# Altium schematic sheet DC-DC Converter.SchDoc
size A
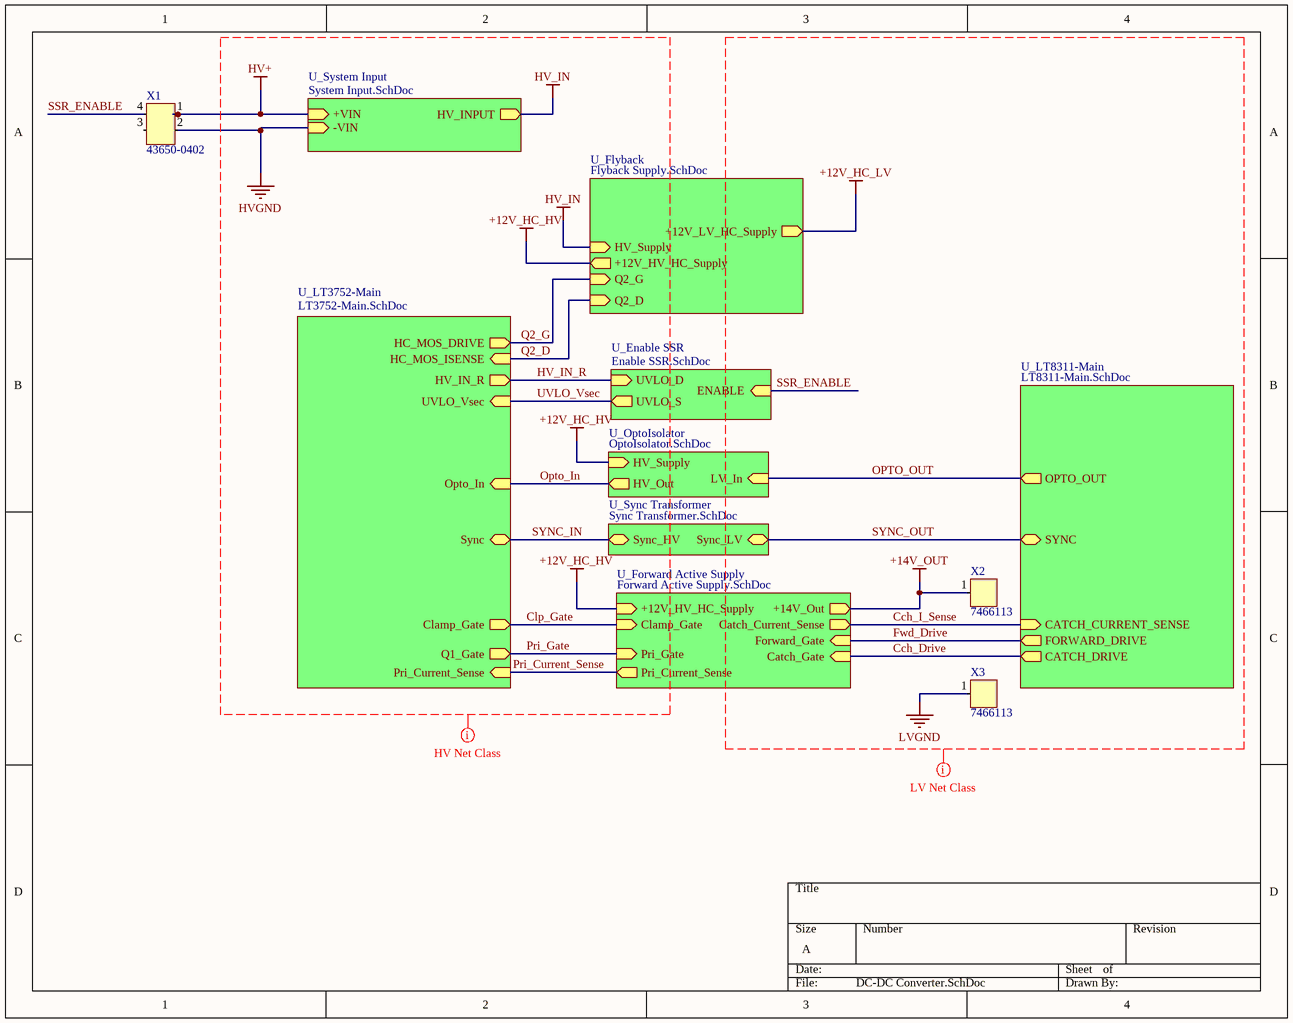
[diagram p0: DC-DC Converter.SchDoc]

## Parts
X1  43650-0402  [Molex_43650_0402]
X2  7466113  [7466113]
X3  7466113  [7466113]

## Sub-sheets
U_Enable SSR = Enable SSR.SchDoc: UVLO_D (in), ENABLE (in), UVLO_S (out)
U_Flyback = Flyback Supply.SchDoc: +12V_LV_HC_Supply (out), HV_Supply (in), Q2_G (in), +12V_HV_HC_Supply (out), Q2_D (in)
U_Forward Active Supply = Forward Active Supply.SchDoc: Clamp_Gate (in), Pri_Gate (in), Pri_Current_Sense (out), +14V_Out (out), Forward_Gate (in), Catch_Gate (in), Catch_Current_Sense (out), +12V_HV_HC_Supply (in)
U_LT3752-Main = LT3752-Main.SchDoc: Sync (bidir), Opto_In (in), Q1_Gate (out), HC_MOS_DRIVE (out), HC_MOS_ISENSE (in), Clamp_Gate (out), Pri_Current_Sense (in), UVLO_Vsec (in), HV_IN_R (out)
U_LT8311-Main = LT8311-Main.SchDoc: OPTO_OUT (out), CATCH_DRIVE (out), CATCH_CURRENT_SENSE (in), FORWARD_DRIVE (out), SYNC (bidir)
U_OptoIsolator = OptoIsolator.SchDoc: HV_Supply (in), HV_Out (out), LV_In (in)
U_Sync Transformer = Sync Transformer.SchDoc: Sync_LV (bidir), Sync_HV (bidir)
U_System Input = System Input.SchDoc: +VIN (in), -VIN (in), HV_INPUT (out)

## Nets
+12V_HC_HV: sheet U_OptoIsolator/HV_Supply, sheet U_Flyback/+12V_HV_HC_Supply, sheet U_Forward Active Supply/+12V_HV_HC_Supply
+12V_HC_LV: sheet U_Flyback/+12V_LV_HC_Supply
+14V_OUT: X2.1 ; sheet U_Forward Active Supply/+14V_Out
HV+: X1.1 ; sheet U_System Input/+VIN
HV_IN: sheet U_Flyback/HV_Supply, sheet U_System Input/HV_INPUT
HVGND: X1.2 ; sheet U_System Input/-VIN
LVGND: X3.1
Cch_Drive: sheet U_LT8311-Main/CATCH_DRIVE, sheet U_Forward Active Supply/Catch_Gate
Cch_I_Sense: sheet U_LT8311-Main/CATCH_CURRENT_SENSE, sheet U_Forward Active Supply/Catch_Current_Sense
Clp_Gate: sheet U_LT3752-Main/Clamp_Gate, sheet U_Forward Active Supply/Clamp_Gate
Fwd_Drive: sheet U_LT8311-Main/FORWARD_DRIVE, sheet U_Forward Active Supply/Forward_Gate
HV_IN_R: sheet U_LT3752-Main/HV_IN_R, sheet U_Enable SSR/UVLO_D
Opto_In: sheet U_OptoIsolator/HV_Out, sheet U_LT3752-Main/Opto_In
OPTO_OUT: sheet U_OptoIsolator/LV_In, sheet U_LT8311-Main/OPTO_OUT
Pri_Current_Sense: sheet U_LT3752-Main/Pri_Current_Sense, sheet U_Forward Active Supply/Pri_Current_Sense
Pri_Gate: sheet U_LT3752-Main/Q1_Gate, sheet U_Forward Active Supply/Pri_Gate
Q2_D: sheet U_LT3752-Main/HC_MOS_ISENSE, sheet U_Flyback/Q2_D
Q2_G: sheet U_LT3752-Main/HC_MOS_DRIVE, sheet U_Flyback/Q2_G
SSR_ENABLE: X1.4 ; sheet U_Enable SSR/ENABLE
SYNC_IN: sheet U_Sync Transformer/Sync_HV, sheet U_LT3752-Main/Sync
SYNC_OUT: sheet U_Sync Transformer/Sync_LV, sheet U_LT8311-Main/SYNC
UVLO_Vsec: sheet U_LT3752-Main/UVLO_Vsec, sheet U_Enable SSR/UVLO_S

Not connected (* = marked no-connect by the designer): X1 3

## Layout directives
net class HV: +12V_HC_HV, Clp_Gate, HV+, HV_IN, HV_IN_R, HVGND, Opto_In, Pri_Current_Sense, Pri_Gate, Q2_D, Q2_G, SYNC_IN, UVLO_Vsec
net class LV: +12V_HC_LV, +14V_OUT, Cch_Drive, Cch_I_Sense, Fwd_Drive, LVGND, OPTO_OUT, SSR_ENABLE, SYNC_OUT

## Library data of the parts
X1 = 6: Manufacturer_id: 4; idConn: 6; Drawer_id: 1; Name: Molex 43650_0402; Value: CONN; Voltage_Rating: 600V; Pitch: 3mm; Created_By: Nick; MfrPartNo: 43650-0402; Num_Contacts: 4; Num_Rows: 1; Package: Conn; Link: https://www.digikey.com/product-detail/en/molex-llc/0436500402/WM11252-ND/3310554; ComponentLink1Description: Datasheet; ComponentLink1URL: https://www.mouser.com/datasheet/2/276/0436500402_PCB_HEADERS-148886.pdf; Supplier1: Digi-Key; Supplier1PartNo: WM11252-ND
X2 X3 = 26: 1 Pin Shank Terminal M3 Surface Mount; Manufacturer_id: 1; idConn: 26; Value: CONN; Created_By: Jason Zhou; Drawer_id: 1; Name: 7466113; Num_Contacts: 1; MfrPartNo: 7466113; Link: https://katalog.we-online.de/en/em/WP-SMSH_PIN; ComponentLink1Description: Datasheet; ComponentLink1URL: https://katalog.we-online.com/em/datasheet/7466113.pdf; Supplier1: Digi-Key; Supplier1PartNo: https://www.digikey.com/product-detail/en/wurth-electronics-inc/7466113/732-5246-ND/4733838; Created_Date: 4/19/2019